# EAGLE design ChipHeadBang (EAGLE 7.2.0)
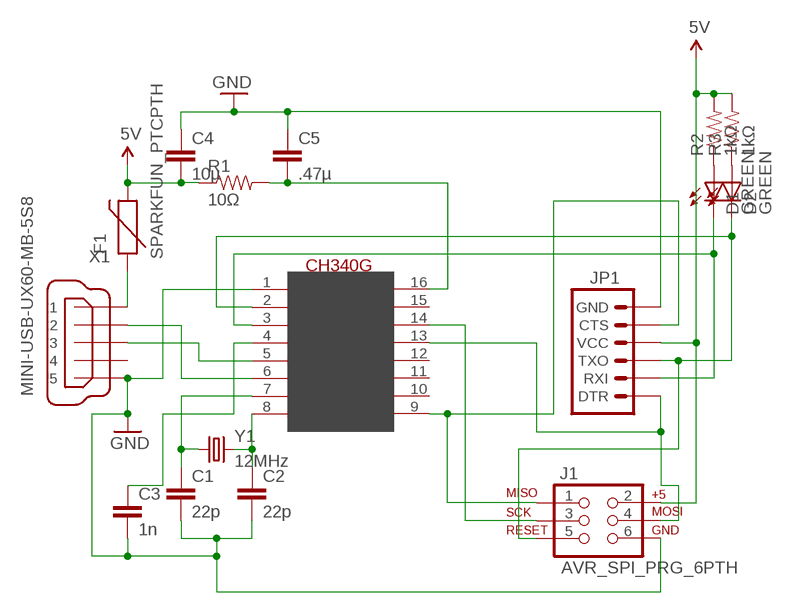
[diagram p0: schematic, sheet 1]

## Parts
C1  22p  CAP0603-CAP  [0603-CAP]
C2  22p  CAP0603-CAP  [0603-CAP]
C3  1n  CAP0603-CAP  [0603-CAP]
C4  10µ  CAP0805  [0805]
C5  .47µ  CAP0805  [0805]
D1  GREEN  LED-GREENLARGE  [LED-1206]
D2  GREEN  LED-GREENLARGE  [LED-1206]
F1  SPARKFUN_PTCPTH  [SPARKFUN_PTC]
J1  AVR_SPI_PRG_6PTH  [2X3]
JP1  ARDUINO_SERIAL_PROGRAMPTH  [1X06]
R1  10Ω  RESISTOR0603-RES  [0603-RES]
R2  1kΩ  RESISTOR0603-RES  [0603-RES]
R3  1kΩ  RESISTOR0603-RES  [0603-RES]
U$1  CH340G  [SOIC16]
X1  MINI-USB-UX60-MB-5S8  [UX60-MB-5S8]
Y1  12MHz  SPARKFUN_CRYSTALHC49US  [SPARKFUN_HC49US]

## Nets
5V: C4.2 F1.P$2 J1.2 JP1.4(VCC) R1.1 R2.2 R3.2
GND: C1.2 C2.2 C3.2 C4.1 C5.1 J1.6 JP1.6(GND) U$1.1(GND) X1.5
N$1: F1.P$1 X1.1
N$2: U$1.6(D-) X1.2
N$3: U$1.5(D+) X1.3
N$4: C5.2 R1.2 U$1.16(VCC)
N$5: C1.1 U$1.7(XI) Y1.1
N$6: C2.1 U$1.8(XO) Y1.2
N$7: D1.A R2.1
N$8: J1.3 U$1.14(RTS)
N$9: C3.1 U$1.4(V3)
N$10: D1.C JP1.2(RXI) U$1.3(RX)
N$11: J1.1 JP1.5(CTS) U$1.9(CTS)
N$12: D2.A R3.1
N$13: D2.C J1.5 JP1.3(TXO) U$1.2(TX)
N$15: J1.4 JP1.1(DTR) U$1.13(DTR)
Unconnected: U$1.10(DSR) U$1.11(RI) U$1.12(DCD) U$1.15(RS232) X1.4

## Library data of the parts
C1-C5 = SparkFun-Passives:CAP: Capacitor Standard 0603 ceramic capacitor, and 0.1" leaded capacitor.
D1 D2 = SparkFun-LED:LED-GREEN: Various green LEDs 0603- DIO-00821 LARGE- DIO-00862 LILYPAD- DIO-09910; PROD_ID: DIO-00862
F1 = DECADE-libraries:SPARKFUN_PTC: Resettable Fuse PTC Resettable Fuse. Spark Fun Electronics SKU : COM-08357
J1 = SparkFun-Connectors:AVR_SPI_PRG_6: AVR ISP 6 Pin This is the reduced ISP connector for AVR programming. Common on Arduino. This footprint will take up less PCB space and can be used with a 10-pin to 6-pin adapter such as SKU: BOB-08508
JP1 = SparkFun-Connectors:ARDUINO_SERIAL_PROGRAM: FTDI connector footprints
R1-R3 = SparkFun-Passives:RESISTOR: Resistor Basic schematic elements and footprints for 0603, 1206, and PTH resistors.
U$1 = usb-serial:CH340G
X1 = con-hirose:MINI-USB-: MINI USB Connector Source: http://www.hirose.co.jp/cataloge_hp/e24000019.pdf; OC_FARNELL: unknown; OC_NEWARK: unknown
Y1 = DECADE-libraries:SPARKFUN_CRYSTAL: Crystals Various standard crystals. Proven footprints. Spark Fun Electronics SKU : COM-00534

## Board
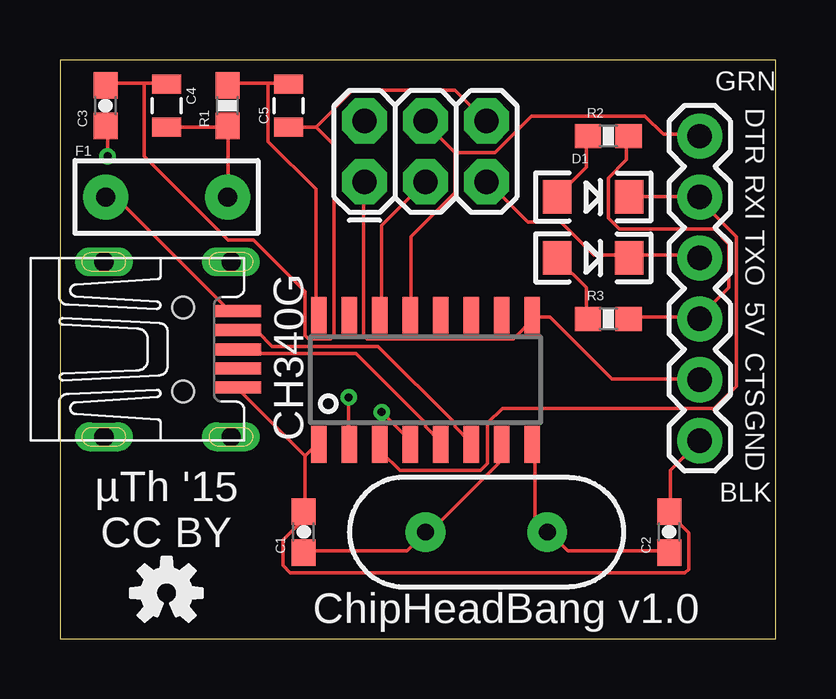
[diagram p1: board, top side]
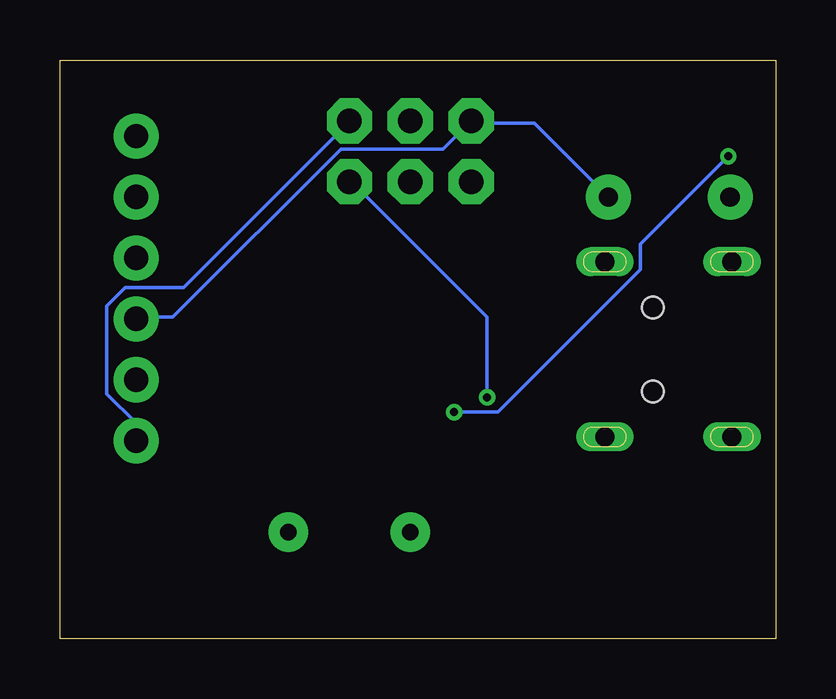
[diagram p2: board, bottom side, seen from below]

Size 29.84 x 24.13 mm. Coordinates in mm from the lower left corner, seen from the top.
Outline: 0,0 29.84,0 29.84,24.13 0,24.13 0,0
Copper layers (1*16): Top 0.0356mm / dielectric 1.5011mm / Bottom 0.0356mm
Design rules "OSHPark": minimum track width 6mil, minimum drill 13mil, track to track 6mil, track to pad 6mil, pad to pad 6mil, via to via 6mil, smd to smd 6mil, copper to edge 15mil, drill to drill 6mil, minimum pad ring 7mil, minimum via ring 7mil, stop-mask expansion 3mil, vias tented up to drill 0mil, thermal gap 10mil

### Footprints (pad centres in the part's own frame; a part is rotated, then mirrored left to right if it is on the bottom)
0603-CAP = smd 1.1 x 1: 1 -0.85,0; 2 0.85,0
0805 = smd 0.8 x 1.2: 1 -0.9,0; 2 0.9,0
LED-1206 = smd 1.2 x 1.4: A -1.5,0; C 1.5,0
SPARKFUN_PTC = drill 0.8 pad 1.88: P$1 -2.54,0; P$2 2.54,0
2X3 = drill 1.016 pad 1.88 octagon: 1 0,0; 2 0,2.54; 3 2.54,0; 4 2.54,2.54; 5 5.08,0; 6 5.08,2.54
1X06 = drill 1.016 pad 1.88: 1 0,0; 2 2.54,0; 3 5.08,0; 4 7.62,0; 5 10.16,0; 6 12.7,0
0603-RES = smd 1.1 x 1: 1 -0.85,0; 2 0.85,0
SOIC16 = smd 0.635 x 1.524: 1 -4.445,-2.695; 2 -3.175,-2.695; 3 -1.905,-2.695; 4 -0.635,-2.695; 5 0.635,-2.695; 6 1.905,-2.695; 7 3.175,-2.695; 8 4.445,-2.695; 9 4.445,2.695; 10 3.175,2.695; 11 1.905,2.695; 12 0.635,2.695; 13 -0.635,2.695; 14 -1.905,2.695; 15 -3.175,2.695; 16 -4.445,2.695
UX60-MB-5S8 = smd 2 x 0.5: 1 8.65,1.6; 2 8.65,0.8; 3 8.65,0; 4 8.65,-0.8; 5 8.65,-1.6 | drill 0.8 long: M1 3.1,-3.65; M2 3.1,3.65; M3 8.4,3.65; M4 8.4,-3.65 | hole 0.9: 6.4,-1.75; 6.4,1.75
SPARKFUN_HC49US = drill 0.7 pad 1.651: 1 -2.54,0; 2 2.54,0

### Placement (x,y rotation side)
C1  10.16,4.45 90 top
C2  25.4,4.45 90 top
C3  1.91,22.23 90 top
C4  4.45,22.23 270 top
C5  9.53,22.23 90 top
D1  22.23,18.41 0 top
D2  22.23,15.88 0 top
F1  4.45,18.41 0 top
J1  12.7,19.05 0 top
JP1  26.67,20.95 270 top
R1  6.99,22.23 90 top
R2  22.86,20.95 0 top
R3  22.86,13.34 0 top
U$1  15.24,10.79 0 top
U$2  [OSHW-LOGO-S]  4.45,1.91 0 top
X1  -1.27,12.06 0 top
Y1  17.78,4.45 0 top

### Tracks (layer width: path | path; a pad name or v marks a point on that pad's centre or on a via)
5V
  Top 0.152: 26.67,13.41 23.77,13.41 R3.2 | 26.67,13.41 27.89,14.63 27.89,16.46 27.28,17.07 23.32,17.07 22.86,17.53 22.86,19.2 23.62,19.96 23.62,20.88 R2.2 | 26.67,13.41 JP1.4 | C4.2 4.57,21.34 6.86,21.34 R1.1 7.01,21.34 7.01,18.44 F1.P$2
  Bottom 0.152: F1.P$2 10.06,21.49 12.65,21.49 J1.2 13.87,20.42 18.14,20.42 25.15,13.41 26.67,13.41 JP1.4
GND
  Top 0.152: 10.21,7.62 10.21,5.33 C1.2 10.06,5.18 10.06,4.88 9.3,4.12 9.3,3.05 9.6,2.74 26.06,2.74 26.21,2.9 26.21,4.42 25.45,5.18 C2.2 25.45,5.33 25.45,7.01 26.67,8.23 JP1.6 | 10.21,7.62 10.67,8.08 U$1.1 | 10.21,7.62 7.47,10.36 X1.5 | 3.5,23.16 4.42,23.16 C4.1 | 3.5,23.16 1.98,23.16 C3.2 | 10.67,21.34 9.6,21.34 C5.1 | 10.67,21.34 12.19,22.86 16.46,22.86 17.68,21.64 J1.6 | 3.5,23.16 3.5,20.12 7.01,16.61 8.08,16.61 10.21,14.48 10.21,12.65 10.36,12.5 11.28,12.5 11.43,12.65 11.43,20.57 10.67,21.34
  Bottom 0.152: JP1.6 26.67,8.99 27.89,10.21 27.89,13.87 27.13,14.63 24.69,14.63 17.83,21.49 J1.6
N$1
  Top 0.152: X1.1 7.32,13.72 7.01,13.72 2.44,18.29 1.98,18.29 F1.P$1
N$2
  Top 0.152: U$1.6 17.07,8.23 16.46,8.84 16.46,8.99 13.26,12.19 8.84,12.19 8.23,12.8 7.47,12.8 X1.2
N$3
  Top 0.152: U$1.5 15.85,8.23 15.24,8.84 15.24,8.99 12.34,11.89 7.62,11.89 7.47,12.04 X1.3
N$4
  Top 0.152: 8.69,23.16 9.45,23.16 C5.2 | 8.69,23.16 7.01,23.16 R1.2 | 8.69,23.16 8.69,20.73 10.67,18.75 10.67,13.56 U$1.16
N$5
  Top 0.152: C1.1 10.21,3.66 14.48,3.66 15.24,4.42 Y1.1 15.24,4.57 15.54,4.57 18.29,7.32 18.29,8.08 U$1.7
N$6
  Top 0.152: C2.1 25.3,3.66 21.18,3.66 20.42,4.42 Y1.2 20.27,4.57 19.81,5.03 19.81,8.08 U$1.8
N$7
  Top 0.152: R2.1 21.95,20.88 21.95,19.66 20.73,18.44 D1.A
N$8
  Top 0.152: J1.3 13.41,17.22 13.41,13.56 U$1.14
N$9  (via drill 0.33)
  Top 0.152: v1.98,20.12 1.98,21.34 C3.1 | v13.41,9.45 14.63,8.23 U$1.4
  Bottom 0.152: v1.98,20.12 5.64,16.46 5.64,15.39 11.58,9.45 v13.41,9.45
N$10
  Top 0.152: D1.C 23.77,18.44 26.67,18.44 JP1.2 26.67,18.29 28.19,16.76 28.19,10.52 27.28,9.6 18.44,9.6 17.83,8.99 17.83,7.32 17.53,7.01 14.17,7.01 13.41,7.77 13.41,8.08 U$1.3
N$11
  Top 0.152: 19.81,13.41 20.42,13.41 23.01,10.82 26.67,10.82 JP1.5 | 19.81,13.41 18.9,12.5 12.8,12.5 12.65,12.65 12.65,19.05 J1.1 | 19.81,13.41 U$1.9
N$12
  Top 0.152: R3.1 21.95,13.41 21.95,14.63 20.73,15.85 D2.A
N$13  (via drill 0.33)
  Top 0.152: JP1.3 26.67,16 23.77,16 D2.C 23.62,16 22.25,16 20.88,17.37 19.51,17.37 17.83,19.05 J1.5 | v12.04,10.06 12.04,8.23 U$1.2
  Bottom 0.152: v12.04,10.06 12.04,13.41 17.68,19.05 J1.5
N$15
  Top 0.152: 16.46,20.27 16.46,18.59 14.63,16.76 14.63,13.56 U$1.13 | 16.46,20.27 15.24,21.49 J1.4 | 16.46,20.27 18.14,20.27 19.66,21.79 24.38,21.79 25.15,21.03 26.67,21.03 JP1.1

### Text on the board
tNames: GRN | DTR | RXI | TXO | 5V | CTS | GND | BLK | µTh '15 / CC BY | ChipHeadBang v1.0